# Altium project LedBoard.PrjPCB
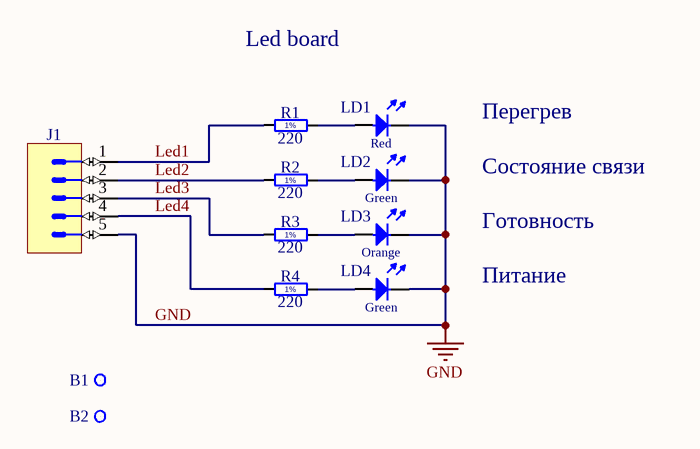
[diagram p0: LedBoard.SchDoc]
1 sheet, 11 parts. Net scope: global (net labels, ports and power ports of the same name join across sheets).
Board file: LedBoard_PCB.PcbDoc

## Sheet LedBoard.SchDoc
size A4

### Parts
B1  Non Plated Hole  [MTG300]  (value not drawn)
B2  Non Plated Hole  [MTG300]  (value not drawn)
J1  KK®  [MOLEX_22-27-2051]  (value not drawn)
LD1  Super Red  [LED_OSRAM_LSR976]  (value not drawn)
LD2  Green  [LED_OSRAM_LGR971]  (value not drawn)
LD3  Orange  [LED_OSRAM_LOR976]  (value not drawn)
LD4  Green  [LED_OSRAM_LGR971]  (value not drawn)
R1  220  [RESC2012X60N]
R2  220  [RESC2012X60N]
R3  220  [RESC2012X60N]
R4  220  [RESC2012X60N]

### Nets
GND: J1.5 LD1.1(C) LD2.1(C) LD3.1(C) LD4.1(C)
Led1: J1.1 R1.1
Led2: J1.2 R2.1
Led3: J1.3 R3.1
Led4: J1.4 R4.1
NetLD1_2: LD1.2(A) R1.2
NetLD2_2: LD2.2(A) R2.2
NetLD3_2: LD3.2(A) R3.2
NetLD4_2: LD4.2(A) R4.2

Not connected (* = marked no-connect by the designer): B1 1; B2 1

### Notes on the sheet
- Led board
- Перегрев
- Состояние связи
- Готовность
- Питание
- (in symbol LED_OSRAM_LSR976) Red
- (in symbol R0805_220R_1%_0.125W_100PPM) 1%

### Library data of the parts
B1 B2 = NON-PLATED_HOLE3.0: Single Terminal Socket; Part Description: Non Plated Through Hole: Hole Dia.=3.0mm; Mounted: No; Table: Pads; Part Number: NON-PLATED_HOLE3.0; Component Kind: Standard (No BOM); Component Type: Standard (No BOM); Pin Count: 1; Family: Non Plated Hole; Socket: No; SMD: No; Status: None; ComponentHeight: 0mm; Author: CERN DEM JLC; CreateDate: 26.05.2008; LatestRevisionDate: 26.05.2008; PackageDescription: Non Plated Through Hole: Hole Dia.=3.0mm
J1 = MOLEX_22-27-2051: Connector 5 Male; Part Description: 2.54mm (.100") Pitch KK® Wire-to-Board Header, Vertical, with Friction Lock, 5 Circuits, Tin (Sn) Plating; Manufacturer: MOLEX; Part Number: MOLEX_22-27-2051; Component Kind: Standard; Component Type: Standard; Pin Count: 5; Family: KK®; Mounted: Yes; Socket: No; SMD: No; Status: None; Manufacturer Part Number: 22-27-2051; ComponentHeight: 11.7mm; HelpURL: \\cern.ch\dfs\Applications\Altium\Datasheets\MOLEX_22-27-2051.pdf; Author: CERN DEM JLC; CreateDate: 04.12.2008; LatestRevisionDate: 04.12.2008; Table: MOLEX
LD1 = LED_OSRAM_LSR976: LED Red 1C 2A; Part Description: Surface Mount Super Red LED (0805 Case); Manufacturer: OSRAM; Manufacturer Part Number: LSR976; Table: LEDs & Displays; Part Number: LED_OSRAM_LSR976; Component Kind: Standard; Component Type: Standard; Color: Super Red; PackageDescription: Super Red Chip LED, 2-Leads, Body 2 x1.25mm, IPC Medium Density; Pin Count: 2; Case: 0805; Mounted: Yes; Socket: No; SMD: Yes; ComponentHeight: 0.9mm; HelpURL: \\cern.ch\dfs\Applications\Altium\Datasheets\LED_OSRAM_LSR976.pdf; Author: CERN DEM JLC; CreateDate: 18.05.2010; LatestRevisionDate: 18.05.2010
LD2 LD4 = LED_OSRAM_LGR971: LED Green 1C 2A; Part Description: Surface Mount Green LED (0805 Case); Manufacturer: OSRAM; Manufacturer Part Number: LGR971; Table: LEDs & Displays; Part Number: LED_OSRAM_LGR971; Component Kind: Standard; Component Type: Standard; Color: Green; PackageDescription: Green Chip LED, 2-Leads, Body 2.0x1.25mm, IPC Medium Density; Pin Count: 2; Case: 0805; Mounted: Yes; Socket: No; SMD: Yes; ComponentHeight: 0.9mm; HelpURL: \\cern.ch\dfs\Applications\Altium\Datasheets\LED_OSRAM_LGR971.pdf; Author: CERN DEM JLC; CreateDate: 28.01.2009; LatestRevisionDate: 17.03.2010
LD3 = LED_OSRAM_LOR976: LED Orange 1C 2A; Part Description: Surface Mount Orange LED (0805 Case); Manufacturer: OSRAM; Manufacturer Part Number: LOR976; Table: LEDs & Displays; Part Number: LED_OSRAM_LOR976; Component Kind: Standard; Component Type: Standard; Color: Orange; PackageDescription: Orange Chip LED, 2-Leads, Body 2 x1.25mm, IPC Medium Density; Pin Count: 2; Case: 0805; Mounted: Yes; Socket: No; SMD: Yes; ComponentHeight: 0.9mm; HelpURL: \\cern.ch\dfs\Applications\Altium\Datasheets\LED_OSRAM_LOR976.pdf; Author: CERN DEM JLC; CreateDate: 18.05.2010; LatestRevisionDate: 18.05.2010
R1-R4 = R0805_220R_1%_0.125W_100PPM: Resistor - 1%; Part Description: General Purpose Thick Film Chip Resistor; Manufacturer: GENERIC; Manufacturer1 Part Number: NRC10F2200TRF; Power: 0.125W; TC: ±100ppm/°C; Table: Resistors SMD; Part Number: R0805_220R_1%_0.125W_100PPM; Component Kind: Standard; Component Type: Standard; Pin Count: 2; Value: 220; Status: Preferred; Tolerance: ±1%; Manufacturer Part Number: R0805_220R_1%_0.125W_100PPM; Case: 0805; Mounted: Yes; Socket: No; SMD: Yes; Manufacturer1 Example: NIC COMPONENT; Manufacturer1 ComponentHeight: 0.6mm; HelpURL: \\cern.ch\dfs\Applications\Altium\Datasheets\R0805_NIC_NRC.pdf; Author: CERN DEM JLC; CreateDate: 03.12.2007; LatestRevisionDate: 13.03.2008